# EAGLE design mapleCUL_small_56 (EAGLE 7.3.0)
MAPLE-CUx Large Version
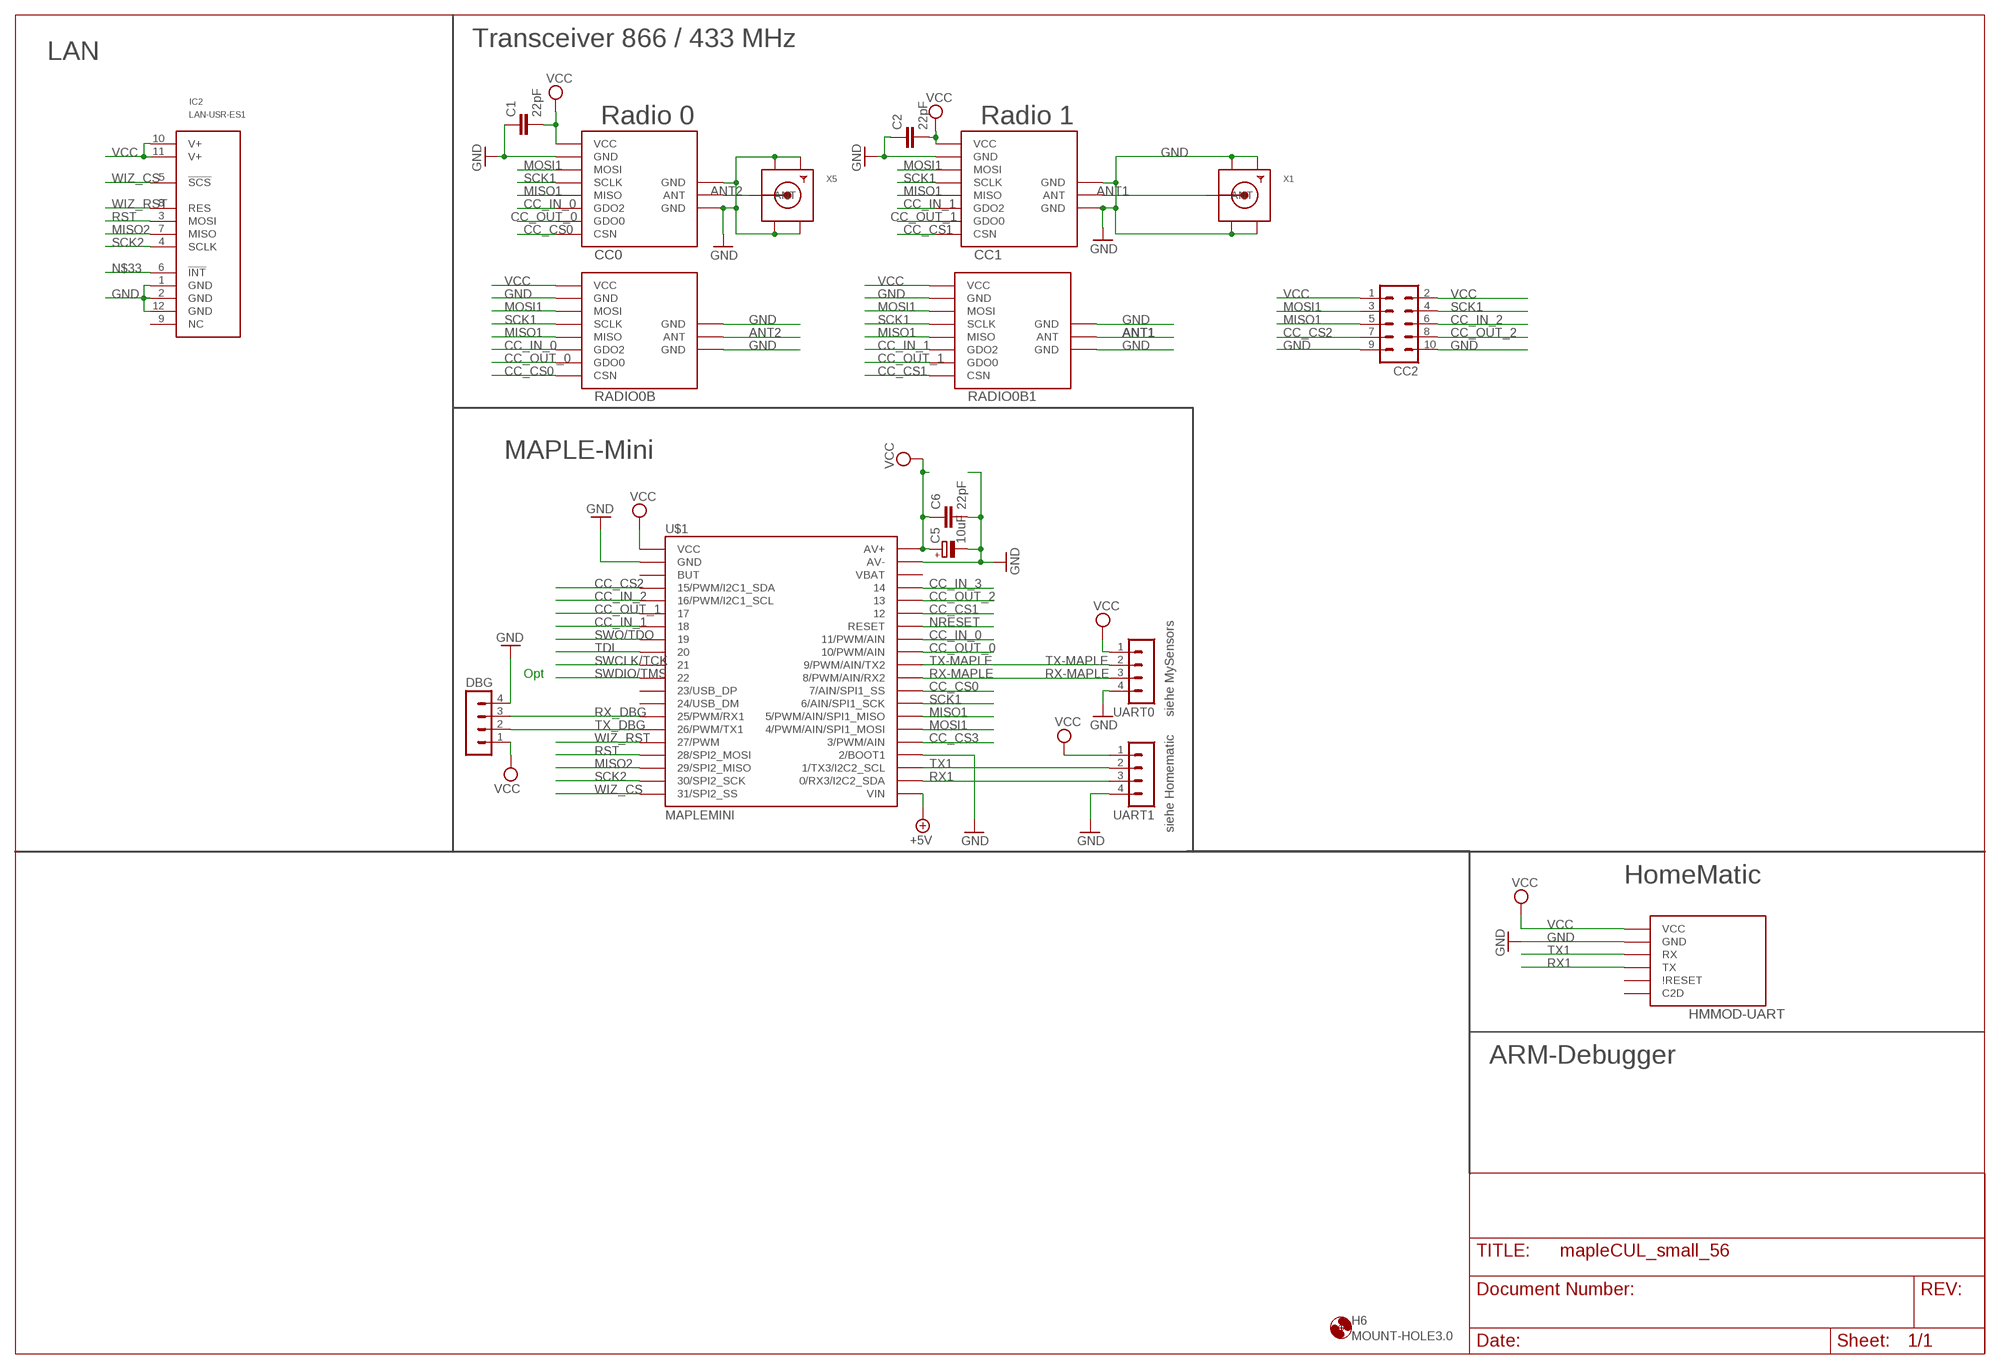
[diagram p0: schematic, sheet 1]

## Parts
C1  22pF  C-EUC0805  [C0805]
C2  22pF  C-EUC0805  [C0805]
C5  10uF  CPOL-EUR/2012-12W  [R/2012-12W]
C6  22pF  C-EUC0805  [C0805]
CC0  CC1101  CC1101_MODULE1SMD  [CC1101_MODULE1_SMD]
CC1  CC1101_MODULE1SMD  [CC1101_MODULE1_SMD]
CC2  MA05-2  [MA05-2]
DBG  MA04-1  [MA04-1]
H6  MOUNT-HOLE3.0  [3,0]
HMMOD-UART  HM-MOD-UARTDIL  [HM-MOD-UART-DIL]
IC2  LAN-USR-ES1  [USR-ES1]
RADIO0B  CC1101_MODULE1SMALL  [CC1101_MODULE1_SMD]
RADIO0B1  CC1101_MODULE1SMALL  [CC1101_MODULE1_SMD]
U$1  MAPLEMINI  [20-DIP]
UART0  MA04-1  [MA04-1]
UART1  MA04-1  [MA04-1]
X1  SMACONNECTOR_EDGE_UFL  [SMA_EDGELAUNCH_UFL]
X5  SMACONNECTOR_EDGE_UFL  [SMA_EDGELAUNCH_UFL]

## Nets
+5V [PWR]: U$1.21(VIN)
ANT1 [PWR]: CC1.ANT RADIO0B1.ANT X1.P(ANT)
ANT2: CC0.ANT RADIO0B.ANT X5.P(ANT)
CC_CS0: CC0.CSN RADIO0B.CSN U$1.29(7/AIN/SPI1_SS)
CC_CS1: CC1.CSN RADIO0B1.CSN U$1.35
CC_CS2: CC2.7 U$1.4(15/PWM/I2C1_SDA)
CC_CS3: U$1.25(3/PWM/AIN)
CC_IN_0: CC0.GDO2 RADIO0B.GDO2 U$1.33(11/PWM/AIN)
CC_IN_1: CC1.GDO2 RADIO0B1.GDO2 U$1.7
CC_IN_2: CC2.6 U$1.5(16/PWM/I2C1_SCL)
CC_IN_3: U$1.37
CC_OUT_0: CC0.GDO0 RADIO0B.GDO0 U$1.32(10/PWM/AIN)
CC_OUT_1: CC1.GDO0 RADIO0B1.GDO0 U$1.6
CC_OUT_2: CC2.8 U$1.36
GND [PWR]: C1.1 C2.1 C5.- C6.2 CC0.GND@0(GND) CC0.GND@1(GND) CC0.GND@2(GND) CC1.GND@0(GND) CC1.GND@1(GND) CC1.GND@2(GND) CC2.9 CC2.10 DBG.4 HMMOD-UART.2(GND) IC2.1(GND) IC2.2(GND) IC2.12(GND) RADIO0B1.GND@0(GND) RADIO0B1.GND@1(GND) RADIO0B1.GND@2(GND) RADIO0B.GND@0(GND) RADIO0B.GND@1(GND) RADIO0B.GND@2(GND) U$1.2(GND) U$1.24(2/BOOT1) U$1.39(AV-) UART0.4 UART1.4 X1.GND@1(GND1) X1.GND@2(GND2) X1.GND@3(GND3) X1.GND@4(GND4) X5.GND@1(GND1) X5.GND@2(GND2) X5.GND@3(GND3) X5.GND@4(GND4)
MISO1: CC0.MISO CC1.MISO CC2.5 RADIO0B1.MISO RADIO0B.MISO U$1.27(5/PWM/AIN/SPI1_MISO)
MISO2: IC2.7(MISO) U$1.18(29/SPI2_MISO)
MOSI1: CC0.MOSI CC1.MOSI CC2.3 RADIO0B1.MOSI RADIO0B.MOSI U$1.26(4/PWM/AIN/SPI1_MOSI)
N$33: IC2.6(!INT!)
NRESET: U$1.34(RESET)
RST: IC2.3(MOSI) U$1.17(28/SPI2_MOSI)
RX1: HMMOD-UART.5(TX) U$1.22(0/RX3/I2C2_SDA) UART1.3
RX-MAPLE: U$1.30(8/PWM/AIN/RX2) UART0.3
RX_DBG: DBG.3 U$1.14(25/PWM/RX1)
SCK1: CC0.SCLK CC1.SCLK CC2.4 RADIO0B1.SCLK RADIO0B.SCLK U$1.28(6/AIN/SPI1_SCK)
SCK2: IC2.4(SCLK) U$1.19(30/SPI2_SCK)
SWCLK/TCK: U$1.10
SWDIO/TMS: U$1.11
SWO/TDO: U$1.8
TDI: U$1.9
TX1: HMMOD-UART.6(RX) U$1.23(1/TX3/I2C2_SCL) UART1.2
TX-MAPLE: U$1.31(9/PWM/AIN/TX2) UART0.2
TX_DBG: DBG.2 U$1.15(26/PWM/TX1)
VCC [PWR]: C1.2 C2.2 C5.+ C6.1 CC0.VCC CC1.VCC CC2.1 CC2.2 DBG.1 HMMOD-UART.1(VCC) IC2.10(V+) IC2.11(V+) RADIO0B1.VCC RADIO0B.VCC U$1.1(VCC) U$1.40(AV+) UART0.1 UART1.1
WIZ_CS: IC2.5(!SCS!) U$1.20(31/SPI2_SS)
WIZ_RST: IC2.8(RES) U$1.16(27/PWM)
Unconnected: HMMOD-UART.3(C2D) HMMOD-UART.4(\!RESET) IC2.9(NC) U$1.3(BUT) U$1.12(23/USB_DP) U$1.13(24/USB_DM) U$1.38(VBAT)

## Notes on the sheet
- Transceiver 866 / 433 MHz
- LAN
- Radio 0 | Radio 1
- MAPLE-Mini
- Opt
- siehe MySensors
- siehe Homematic
- HomeMatic
- ARM-Debugger

## Library data of the parts
C1 C2 C6 = rcl:C-EU: CAPACITOR, European symbol
C5 = rcl:CPOL-EU: POLARIZED CAPACITOR, European symbol
CC0 CC1 = wireless:CC1101_MODULE1: CC1101 wireless module for 433/868 MHz (sold from Aliexpress). DIL version for mounting with pin header (and SMD soldering) and SMD only variant available.
CC2 = con-lstb:MA05-2: PIN HEADER; OC_FARNELL: unknown; OC_NEWARK: unknown
DBG UART0 UART1 = con-lstb:MA04-1: PIN HEADER; OC_FARNELL: unknown; OC_NEWARK: unknown
H6 = holes:MOUNT-HOLE: MOUNTING HOLE with drill center marker
HMMOD-UART = wireless:HM-MOD-UART: eQ3 HM-MOD-UART-AW-SH2 wireless module for 868 MHz. DIL version for mounting with pin header (antenna upwards) and SMD variant available (antenna downwards).
IC2 = Martin-Communication:LAN-USR-ES1
RADIO0B RADIO0B1 = Martin-Communication:CC1101_MODULE1: CC1101 wireless module for 433/868 MHz (sold from Aliexpress). DIL version for mounting with pin header (and SMD soldering) and SMD only variant available.
U$1 = maplemini-small:MAPLEMINI
X1 X5 = adafruit:SMACONNECTOR: SMA Connector 90° DIP SMA Connector, 50 Ohm (4UConnector: 07259)

## Net classes
0 default: width 0.305 mm
1 PWR: width 0.305 mm

## Board
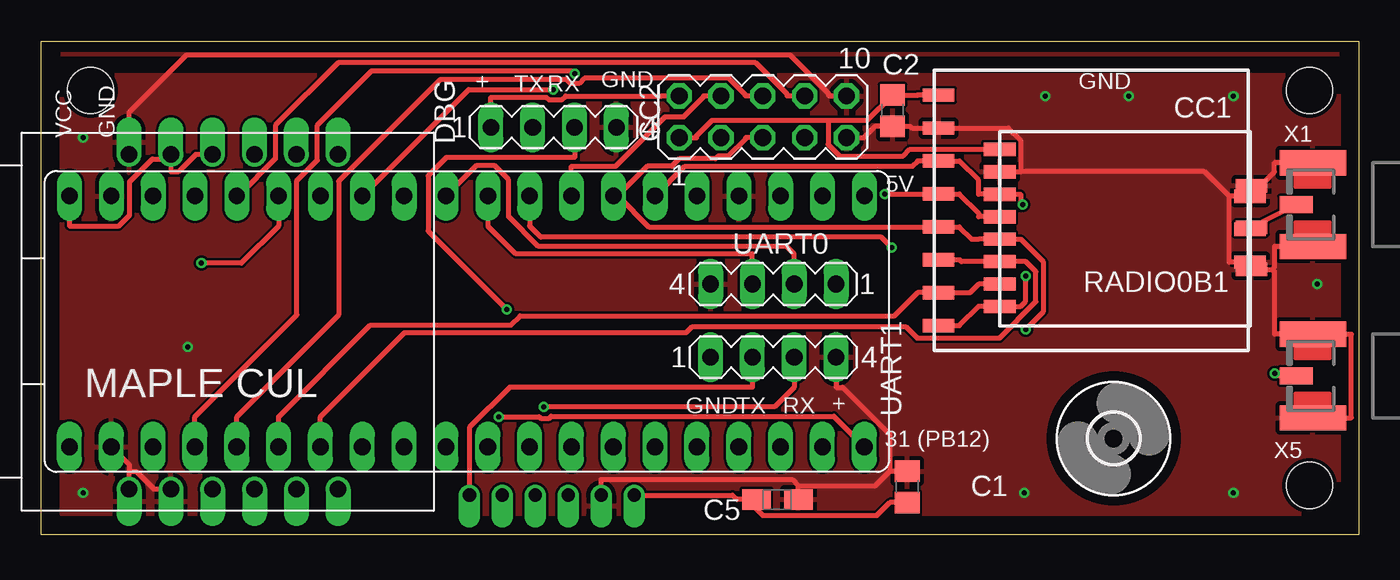
[diagram p1: board, top side]
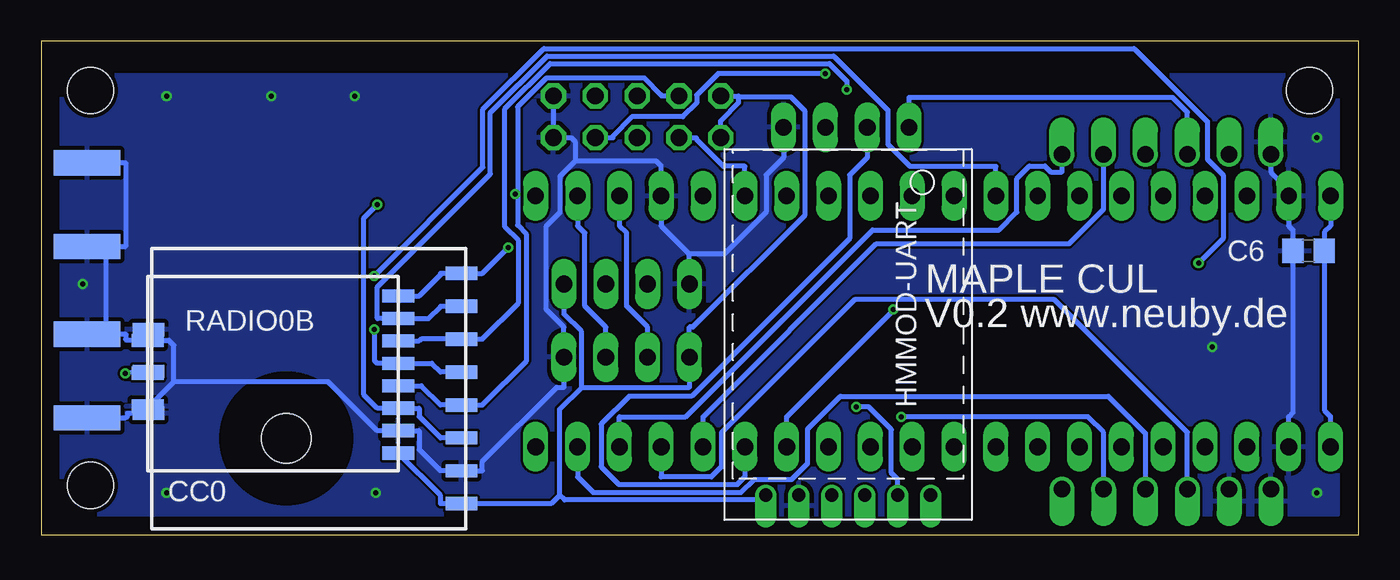
[diagram p2: board, bottom side, seen from below]

Size 80 x 30 mm. Coordinates in mm from the lower left corner, seen from the top.
Outline: 0,0 0,30 80,30 80,0 1,0 0,0
Copper layers (1*16): Top 0.035mm / dielectric 1.5mm / Bottom 0.035mm
Design rules "Fusion_eagle_rule_v1.1": minimum track width 6mil, minimum drill 12mil, track to track 6mil, track to pad 6mil, pad to pad 6mil, via to via 6mil, smd to smd 0mil, copper to edge 10mil, drill to drill 10mil, minimum pad ring 10mil, minimum via ring 6mil, stop-mask expansion 2mil, vias tented up to drill 100mil, thermal gap 10mil
Holes 2.8 mm at 3,27 77,27 77,3
tRestrict: 1 lines
bRestrict: 1 lines

### Footprints (pad centres in the part's own frame; a part is rotated, then mirrored left to right if it is on the bottom)
C0805 = smd 1.3 x 1.5: 1 -0.95,0; 2 0.95,0
R/2012-12W = smd 1.75 x 1.26: + 1.275,0; - -1.275,0
CC1101_MODULE1_SMD = smd 1.93 x 0.813: ANT 19,5.96; CSN 0,0; GDO0 0,2; GDO2 0,4; GND@0 0,12; GND@1 19,8.5; GND@2 19,3.42; MISO 0,6; MOSI 0,10; SCLK 0,8; VCC 0,14
MA05-2 = drill 1.016 octagon: 1 -5.08,-1.27; 2 -5.08,1.27; 3 -2.54,-1.27; 4 -2.54,1.27; 5 0,-1.27; 6 0,1.27; 7 2.54,-1.27; 8 2.54,1.27; 9 5.08,-1.27; 10 5.08,1.27
MA04-1 = drill 1.016 long: 1 -3.81,0; 2 -1.27,0; 3 1.27,0; 4 3.81,0
3,0 = hole 3: 0,0
HM-MOD-UART-DIL = drill 0.8 offset: 1 0,12; 2 0,10; 3 0,8; 4 0,6; 5 0,4; 6 0,2
USR-ES1 = drill 1 pad 1.35 offset: 1 -10.16,5.715; 2 -10.16,3.175; 3 -10.16,0.635; 4 -10.16,-1.905; 5 -10.16,-4.445; 6 -10.16,-6.985; 7 10.16,-6.985; 8 10.16,-4.445; 9 10.16,-1.905; 10 10.16,0.635; 11 10.16,3.175; 12 10.16,5.715
CC1101_MODULE1_SMD' = smd 1.93 x 0.813: ANT 14.889,4.381; CSN -0.318,-0.318; GDO0 -0.318,1.048; GDO2 -0.318,2.413; GND@0 -0.318,7.872; GND@1 14.889,6.381; GND@2 14.889,2.381; MISO -0.318,3.777; MOSI -0.318,6.508; SCLK -0.318,5.143; VCC -0.318,9.238
20-DIP = drill 1.016 pad 1.27 long: 1 -24.13,-7.62; 2 -21.59,-7.62; 3 -19.05,-7.62; 4 -16.51,-7.62; 5 -13.97,-7.62; 6 -11.43,-7.62; 7 -8.89,-7.62; 8 -6.35,-7.62; 9 -3.81,-7.62; 10 -1.27,-7.62; 11 1.27,-7.62; 12 3.81,-7.62; 13 6.35,-7.62; 14 8.89,-7.62; 15 11.43,-7.62; 16 13.97,-7.62; 17 16.51,-7.62; 18 19.05,-7.62; 19 21.59,-7.62; 20 24.13,-7.62 | drill 1 pad 1.27 long: 21 24.13,7.62; 22 21.59,7.62; 23 19.05,7.62; 24 16.51,7.62; 25 13.97,7.62; 26 11.43,7.62; 27 8.89,7.62; 28 6.35,7.62; 29 3.81,7.62; 30 1.27,7.62; 31 -1.27,7.62; 32 -3.81,7.62; 33 -6.35,7.62; 34 -8.89,7.62; 35 -11.43,7.62; 36 -13.97,7.62; 37 -16.51,7.62; 38 -19.05,7.62; 39 -21.59,7.62; 40 -24.13,7.62
SMA_EDGELAUNCH_UFL = smd 4.064 x 1.524: GND@1 2.032,-2.54; GND@2 2.032,2.54 | smd 4.064 x 1.524 bottom: GND@3 2.032,2.54; GND@4 2.032,-2.54 | smd 2.032 x 1.016: P 3.048,0

### Placement (x,y rotation side)
C1  52.58,2.92 270 top
C2  51.69,25.78 90 top
C5  44.7,2.14 180 top
C6  3.05,17.26 180 bottom
CC0  54.48,15.89 180 bottom
CC1  54.48,12.72 0 top
CC2  43.81,25.4 0 top
DBG  31.11,24.77 0 top
H6  65.11,5.85 0 top
HMMOD-UART  24,2.41 90 bottom
IC2  11.05,12.95 90 top
RADIO0B  CC1101_MODULE1SMALL  [CC1101_MODULE1_SMD']  58.63,14.19 180 bottom
RADIO0B1  CC1101_MODULE1SMALL  [CC1101_MODULE1_SMD']  58.51,14.19 0 top
U$1  25.84,12.97 0 top
UART0  44.45,15.24 180 top
UART1  44.45,10.79 0 top
X1  79.25,20.07 180 top
X5  79.25,9.65 180 top

### Tracks (layer width: path | path; a pad name or v marks a point on that pad's centre or on a via)
ANT1
  Top 0.305: RADIO0B1.ANT 73.48,18.66 CC1.ANT X1.P
ANT2  (via drill 0.3 pad 0.61)
  Top 0.305: X5.P 74.88,9.65 74.88,9.84 v74.91,9.81
  Bottom 0.305: v74.91,9.81 73.48,10.04 CC0.ANT 73.48,9.85 RADIO0B.ANT
CC_CS0  (via drill 0.3 pad 0.61)
  Top 0.305: v51.64,17.46 51.01,18.09 30.34,18.09 29.65,18.78 U$1.29
  Bottom 0.305: v51.64,17.46 53.21,15.89 CC0.CSN 55.75,15.89 55.75,15.81 57.05,14.51 RADIO0B.CSN
CC_CS1  (via drill 0.3 pad 0.61)
  Top 0.305: v59.78,15.73 59.78,14.19 59.46,13.88 RADIO0B1.CSN 56.91,13.88 55.75,12.72 CC1.CSN | U$1.35 14.41,18.78 12.15,16.51 v9.73,16.51
  Bottom 0.305: v59.78,15.73 53.18,22.33 53.18,25.85 49.48,29.55 13.64,29.55 9.2,25.11 9.2,22.83 8.24,21.87 8.24,18 v9.73,16.51
CC_CS2  (via drill 0.3 pad 0.61)
  Top 0.305: U$1.4 9.34,7.18 15.52,13.37 15.52,21.53 16.76,22.77 16.76,24.89 20.07,28.2 32.24,28.2 v32.4,28.03
  Bottom 0.305: CC2.7 45.29,24.13 45.29,24.24 44.13,25.4 41.03,25.4 40.21,26.23 40.21,26.72 38.9,28.03 v32.4,28.03
CC_IN_0  (via drill 0.3 pad 0.61)
  Top 0.305: U$1.33 25.96,27.05 v31.09,27.05
  Bottom 0.305: v31.09,27.05 31.09,27.57 32.15,28.64 49.1,28.64 51.85,25.89 51.85,18.71 51.01,17.87 51.01,14.09 53.21,11.89 CC0.GDO2 56.94,11.89 57.05,11.78 RADIO0B.GDO2
CC_IN_1
  Top 0.305: U$1.7 16.95,7.18 22.07,12.29 39.16,12.29 39.53,12.66 52.48,12.66 53.19,11.96 58.19,11.96 60.4,14.17 60.4,15.99 59.78,16.61 RADIO0B1.GDO2 55.86,16.61 55.75,16.72 CC1.GDO2
CC_IN_2
  Top 0.305: CC2.6 42.75,26.67 42.75,26.75 41.76,27.74 32.98,27.74 32.66,27.42 32.15,27.42 31.91,27.66 24.24,27.66 18.06,21.48 18.06,13.37 11.87,7.18 U$1.5
CC_OUT_0
  Bottom 0.305: U$1.32 22.04,22.4 27.26,22.4 28.59,23.73 28.59,25.81 31.88,29.1 49.29,29.1 52.72,25.66 52.72,21.93 59.59,15.06 59.59,13.15 RADIO0B.GDO0 56.5,13.15 55.75,13.89 CC0.GDO0
CC_OUT_1
  Top 0.305: U$1.6 14.41,7.18 19.98,12.75 28.51,12.75 29.07,13.31 51.81,13.31 53.21,14.72 CC1.GDO0 56.4,14.72 56.92,15.24 RADIO0B1.GDO0
CC_OUT_2
  Top 0.305: U$1.36 11.96,20.59 14.22,22.85 14.22,24.89 18.03,28.69 43.38,28.69 45.29,26.78 45.29,26.67 CC2.8
GND  (via drill 0.3 pad 0.61)
  Top 0.305: 59.46,22.07 59.46,23.97 58.72,24.72 CC1.GND@0 52.86,24.72 52.74,24.83 C2.1 50.63,24.83 49.96,24.16 49.96,24.13 CC2.9 | IC2.12 5.33,25.68 8.8,29.14 45.49,29.14 47.83,26.8 47.83,26.67 CC2.10 | UART1.4 48.26,8.97 48.66,8.97 51.52,6.1 51.52,3.87 | U$1.2 5.33,4.27 5.33,3.85 | X5.GND@2 79.55,7.11 79.55,12.19 X5.GND@1 74.88,12.19 74.88,16.01 74.75,16.14 | 74.75,16.14 74.88,16.26 74.88,17.53 X1.GND@3 | X1.GND@1 74.88,22.61 74.88,22.06 74.04,21.22 | 74.04,21.22 RADIO0B1.GND@1 72.13,20.57 | 73.04,16.57 CC1.GND@2 74.75,16.14 | RADIO0B1.GND@2 73.04,16.57 | 73.04,16.57 72.76,16.57 72.13,16.57 72.13,20.57 | 72.13,20.57 70.64,22.07 59.46,22.07 | RADIO0B1.GND@0 59.46,22.07 | CC1.GND@1 74.04,21.22 | IC2.1 5.33,3.85 | 5.33,3.85 5.77,3.85 6.83,2.79 IC2.2 | 45.98,2.99 50.64,2.99 51.52,3.87 | 45.98,2.99 45.6,3.37 34,3.37 HMMOD-UART.2 | 45.98,2.99 45.98,2.61 C5.- | C1.1 51.52,3.87
  Bottom 0.305: U$1.2 4.25,7.18 4,7.43 C6.2 4,18.52 4.25,18.78 U$1.39 4.25,20.98 5.33,22.05 IC2.12 | 40.64,17.07 42.35,18.78 U$1.24 42.35,22.4 42.69,22.73 47.55,22.73 | 76.05,17.53 74.88,17.53 74.88,22.61 X1.GND@1 | X1.GND@3 76.05,17.53 | 76.05,12.19 74.88,12.19 74.88,11.9 74.79,11.81 RADIO0B.GND@2 72.89,11.81 | X5.GND@1 76.05,12.19 | 76.05,12.19 76.05,17.53 | X5.GND@2 74.88,7.11 74.75,7.24 74.75,7.39 CC0.GND@1 73.48,7.77 | 72.89,11.81 73.48,12.41 CC0.GND@2 | 72.89,11.81 72.25,11.81 71.95,11.51 71.95,9.31 | 71.95,9.31 73.48,7.77 | 71.95,9.31 62.57,9.31 59.59,6.32 58.95,6.32 RADIO0B.GND@0 57.05,6.32 57.05,5.18 55.75,3.89 CC0.GND@0 53.21,3.89 53.21,4.46 48.7,8.97 48.26,8.97 UART1.4 48.26,12.62 49.33,13.69 49.33,18.78 48.49,19.61 48.49,21.79 47.55,22.73 | RADIO0B.GND@1 73.48,7.77 | 40.64,17.07 38.53,17.07 35.99,19.61 35.99,21.87 34.92,22.94 DBG.4 | 47.55,22.73 47.55,23.86 47.83,24.13 CC2.9 CC2.10 | UART0.4 40.64,17.07
  other vias: 2.54,24.13 2.54,2.54 8.89,11.43 60.96,26.67 66.04,26.67 72.39,26.67 59.69,2.54 72.39,2.54 77.47,15.24
  pour Top: 1.27,29.21 78.74,29.21 78.74,1.27 1.27,1.27
  pour Bottom: 1.27,29.21 78.74,29.21 78.74,1.27 1.27,1.27
MISO1  (via drill 0.3 pad 0.61)
  Top 0.305: v59.77,12.49 60.87,13.59 60.87,16.57 59.46,17.97 RADIO0B1.MISO 56.92,17.97 56.5,17.97 55.75,18.72 CC1.MISO 36.9,18.72 35.01,20.61 | 35.01,20.61 36.8,22.4 38.29,22.4 38.75,22.86 40.94,22.86 41.08,23 41.73,23 42.75,24.02 42.75,24.13 CC2.5 | U$1.27 34.75,20.61 35.01,20.61 | 35.01,20.61
  Bottom 0.305: v59.77,12.49 59.77,10.6 59.59,10.42 RADIO0B.MISO 56.28,10.42 55.75,9.89 CC0.MISO
MISO2
  Bottom 0.305: IC2.7 18.03,22.05 18.71,22.05 19.07,22.41 20,22.41 20.77,21.65 20.77,19.61 21.84,18.53 29.52,18.53 40.87,7.18 44.9,7.18 U$1.18
MOSI1  (via drill 0.3 pad 0.61)
  Top 0.305: v59.6,20.06 59.46,20.2 59.46,20.7 RADIO0B1.MOSI 57.56,20.7 56.92,20.7 56.92,21.55 55.75,22.72 CC1.MOSI 53.21,22.72 52.9,22.4 39.09,22.4 U$1.26
  Bottom 0.305: v59.6,20.06 60.41,19.25 60.41,8.51 59.59,7.69 RADIO0B.MOSI 57.05,7.69 57.05,7.18 55.75,5.89 CC0.MOSI | CC2.3 40.21,24.13 40.21,24.02 38.59,22.4 37.27,22.4 U$1.26
RST
  Bottom 0.305: IC2.3 10.41,6.23 18.48,14.3 30.61,14.3 38.71,6.2 38.71,4.12 39.3,3.52 42.35,3.52 U$1.17
RX1  (via drill 0.3 pad 0.61)
  Top 0.305: v30.51,7.78 44.53,7.78 45.72,8.97 UART1.3
  Bottom 0.305: v30.51,7.78 29.76,7.78 28.38,6.41 28.38,3.75 28,3.37 HMMOD-UART.5 | U$1.22 47.43,18.78 47,18.34 47,13.9 45.72,12.62 UART1.3
RX-MAPLE
  Top 0.305: U$1.30 27.11,18.78 28.82,17.07 43.18,17.07 UART0.3
RX_DBG  (via drill 0.3 pad 0.61)
  Top 0.305: v28.27,13.69 23.5,18.46 23.5,21.83 24.61,22.94 32.38,22.94 DBG.3
  Bottom 0.305: v28.27,13.69 28.27,13.64 34.73,7.18 U$1.14
SCK1  (via drill 0.3 pad 0.61)
  Top 0.305: RADIO0B1.SCLK 56.92,19.34 56.92,19.55 55.75,20.72 CC1.SCLK v51.21,20.72 | CC2.4 40.21,26.67 40.21,26.59 39.02,25.4 37.88,25.4 34.88,22.4 32.19,22.4 U$1.28
  Bottom 0.305: 51.07,20.72 51.07,18.81 50.55,18.29 50.55,10.55 53.21,7.89 CC0.SCLK 55.75,7.89 56.91,9.05 RADIO0B.SCLK | 51.07,20.72 51.07,26.01 49.33,27.75 43.37,27.75 42.34,26.72 42.34,26.67 CC2.4 | 51.07,20.72 v51.21,20.72
SCK2
  Bottom 0.305: U$1.19 47.43,3.52 46.48,2.57 37.51,2.57 36.71,3.37 34.44,3.37 33.47,4.34 33.47,6.43 31.48,8.41 15.2,8.41 12.95,6.17 IC2.4
TX1
  Top 0.305: HMMOD-UART.6 26,6.53 28.44,8.97 43.18,8.97 UART1.2
  Bottom 0.305: U$1.23 44.9,18.78 44.46,18.34 44.46,13.9 43.18,12.62 UART1.2
TX-MAPLE
  Top 0.305: UART0.2 45.72,17.07 45.26,17.53 30.19,17.53 28.38,19.33 28.38,21.59 27.55,22.42 26.41,22.42 U$1.31
TX_DBG
  Bottom 0.305: DBG.2 29.84,22.94 30.91,21.87 30.91,18.02 40.51,8.41 44.31,8.41 46,6.73 46,4.13 44.93,3.06 37.73,3.06 37.27,3.52 U$1.15
VCC
  Top 0.305: 47.79,25.2 50.16,25.2 C2.2 | 47.79,25.2 40.73,25.2 39.8,24.26 39.8,24.13 CC2.1 | 47.79,25.2 47.79,23.72 48.48,23.02 52.34,23.02 52.75,23.43 RADIO0B1.VCC | C2.2 53.2,26.72 53.21,26.72 CC1.VCC | C2.2 | U$1.40 1.71,18.78 4.71,18.78 5.36,19.43 5.36,21.45 6.75,22.84 7.87,22.84 | 7.87,22.84 7.87,22.05 8.31,22.05 9.37,23.11 IC2.10 | IC2.11 7.87,22.84 | C1.2 51.52,1.97 50.74,1.18 43.8,1.18 42.84,2.14 | 42.84,2.14 42.25,2.14 41.98,2.41 HMMOD-UART.1 | C5.+ 42.84,2.14 | CC2.2 37.67,26.67 31.84,26.67 31.6,26.43 30.84,26.43 30.68,26.59 27.3,26.59 DBG.1
  Bottom 0.305: 47.19,8.97 47.19,12.34 48.26,13.41 UART0.1 | 48.52,2.41 48.52,7.64 47.19,8.97 | 47.19,8.97 40.64,8.97 UART1.1 40.64,12.62 40.42,12.62 33.66,19.39 33.66,25.79 34.49,26.62 37.66,26.62 | HMMOD-UART.1 36.3,2.11 48.22,2.11 48.52,2.41 | IC2.10 10.41,25.68 11.33,26.59 27.3,26.59 DBG.1 | 37.66,26.62 37.66,26.25 38.72,25.2 38.73,25.2 CC2.1 | 37.66,26.62 37.67,26.62 37.67,26.67 CC2.2 | 48.52,2.41 49.04,1.89 CC0.VCC 55.75,1.89 55.75,2.39 RADIO0B.VCC | U$1.1 1.71,7.18 2.1,7.56 C6.1 2.1,18.39 1.71,18.78 U$1.40
WIZ_CS  (via drill 0.3 pad 0.61)
  Top 0.305: v27.78,7.18 30.23,7.18 30.32,7.09 30.86,7.09 30.97,7.2 48.12,7.2 U$1.20
  Bottom 0.305: IC2.5 15.49,6.22 16.46,7.18 v27.78,7.18
WIZ_RST
  Bottom 0.305: U$1.16 39.81,7.18 29.3,17.7 17.59,17.7 15.49,19.79 IC2.8

### Text on the board
tNames: TX | RX | GND | + | GND | VCC | GND | 5V | MAPLE CUL | RX | GND | TX | + | 31 (PB12)
bNames: MAPLE CUL | V0.2 www.neuby.de